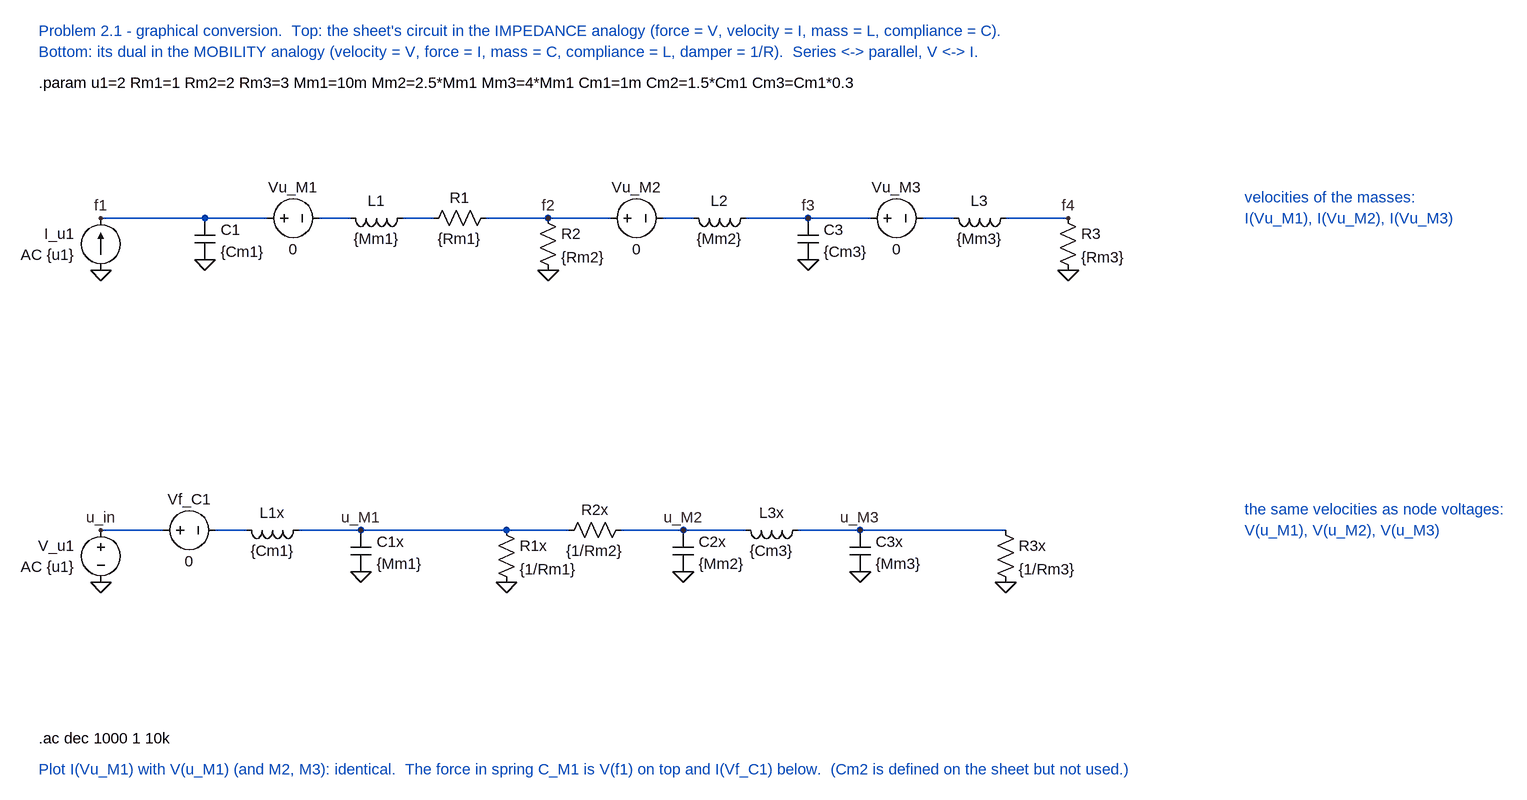
[diagram p0: schematic P2_1_Graphical_Conversion.asc]
P2_1_Graphical_Conversion.asc, the LTspice schematic file:
Version 4
SHEET 1 3000 1600
WIRE 0 0 256 0
WIRE 336 0 384 0
WIRE 464 0 512 0
WIRE 592 0 688 0
WIRE 688 0 784 0
WIRE 864 0 912 0
WIRE 992 0 1088 0
WIRE 1088 0 1184 0
WIRE 1264 0 1312 0
WIRE 1392 0 1488 0
WIRE 0 480 96 480
WIRE 176 480 224 480
WIRE 304 480 400 480
WIRE 400 480 720 480
WIRE 800 480 896 480
WIRE 896 480 992 480
WIRE 1072 480 1168 480
WIRE 1168 480 1392 480
FLAG 0 80 0
FLAG 0 0 f1
FLAG 160 64 0
FLAG 688 80 0
FLAG 688 0 f2
FLAG 1088 64 0
FLAG 1088 0 f3
FLAG 1488 80 0
FLAG 1488 0 f4
FLAG 0 560 0
FLAG 0 480 u_in
FLAG 400 480 u_M1
FLAG 400 544 0
FLAG 624 560 0
FLAG 896 480 u_M2
FLAG 896 544 0
FLAG 1168 480 u_M3
FLAG 1168 544 0
FLAG 1392 560 0
SYMBOL current 0 80 R180
WINDOW 0 40 56 Left 2
WINDOW 3 40 24 Left 2
SYMATTR InstName I_u1
SYMATTR Value AC {u1}
SYMBOL cap 144 0 R0
WINDOW 0 40 18 Left 2
WINDOW 3 40 52 Left 2
SYMATTR InstName C1
SYMATTR Value {Cm1}
SYMBOL voltage 240 0 R270
WINDOW 0 32 56 VTop 2
WINDOW 3 -32 56 VBottom 2
SYMATTR InstName Vu_M1
SYMATTR Value 0
SYMBOL ind 480 -16 R90
WINDOW 0 5 56 VBottom 2
WINDOW 3 32 56 VTop 2
SYMATTR InstName L1
SYMATTR Value {Mm1}
SYMATTR SpiceLine Rser=0
SYMBOL res 608 -16 R90
WINDOW 0 0 56 VBottom 2
WINDOW 3 32 56 VTop 2
SYMATTR InstName R1
SYMATTR Value {Rm1}
SYMBOL res 672 -16 R0
SYMATTR InstName R2
SYMATTR Value {Rm2}
SYMBOL voltage 768 0 R270
WINDOW 0 32 56 VTop 2
WINDOW 3 -32 56 VBottom 2
SYMATTR InstName Vu_M2
SYMATTR Value 0
SYMBOL ind 1008 -16 R90
WINDOW 0 5 56 VBottom 2
WINDOW 3 32 56 VTop 2
SYMATTR InstName L2
SYMATTR Value {Mm2}
SYMATTR SpiceLine Rser=0
SYMBOL cap 1072 0 R0
WINDOW 0 40 18 Left 2
WINDOW 3 40 52 Left 2
SYMATTR InstName C3
SYMATTR Value {Cm3}
SYMBOL voltage 1168 0 R270
WINDOW 0 32 56 VTop 2
WINDOW 3 -32 56 VBottom 2
SYMATTR InstName Vu_M3
SYMATTR Value 0
SYMBOL ind 1408 -16 R90
WINDOW 0 5 56 VBottom 2
WINDOW 3 32 56 VTop 2
SYMATTR InstName L3
SYMATTR Value {Mm3}
SYMATTR SpiceLine Rser=0
SYMBOL res 1472 -16 R0
SYMATTR InstName R3
SYMATTR Value {Rm3}
SYMBOL voltage 0 464 R0
WINDOW 0 -40 40 Right 2
WINDOW 3 -40 72 Right 2
SYMATTR InstName V_u1
SYMATTR Value AC {u1}
SYMBOL voltage 80 480 R270
WINDOW 0 32 56 VTop 2
WINDOW 3 -32 56 VBottom 2
SYMATTR InstName Vf_C1
SYMATTR Value 0
SYMBOL ind 320 464 R90
WINDOW 0 5 56 VBottom 2
WINDOW 3 32 56 VTop 2
SYMATTR InstName L1x
SYMATTR Value {Cm1}
SYMATTR SpiceLine Rser=0
SYMBOL cap 384 480 R0
WINDOW 0 40 18 Left 2
WINDOW 3 40 52 Left 2
SYMATTR InstName C1x
SYMATTR Value {Mm1}
SYMBOL res 608 464 R0
SYMATTR InstName R1x
SYMATTR Value {1/Rm1}
SYMBOL res 816 464 R90
WINDOW 0 0 56 VBottom 2
WINDOW 3 32 56 VTop 2
SYMATTR InstName R2x
SYMATTR Value {1/Rm2}
SYMBOL cap 880 480 R0
WINDOW 0 40 18 Left 2
WINDOW 3 40 52 Left 2
SYMATTR InstName C2x
SYMATTR Value {Mm2}
SYMBOL ind 1088 464 R90
WINDOW 0 5 56 VBottom 2
WINDOW 3 32 56 VTop 2
SYMATTR InstName L3x
SYMATTR Value {Cm3}
SYMATTR SpiceLine Rser=0
SYMBOL cap 1152 480 R0
WINDOW 0 40 18 Left 2
WINDOW 3 40 52 Left 2
SYMATTR InstName C3x
SYMATTR Value {Mm3}
SYMBOL res 1376 464 R0
SYMATTR InstName R3x
SYMATTR Value {1/Rm3}
TEXT -96 -288 Left 2 ;Problem 2.1 - graphical conversion.  Top: the sheet's circuit in the IMPEDANCE analogy (force = V, velocity = I, mass = L, compliance = C).
TEXT -96 -256 Left 2 ;Bottom: its dual in the MOBILITY analogy (velocity = V, force = I, mass = C, compliance = L, damper = 1/R).  Series <-> parallel, V <-> I.
TEXT -96 -208 Left 2 !.param u1=2 Rm1=1 Rm2=2 Rm3=3 Mm1=10m Mm2=2.5*Mm1 Mm3=4*Mm1 Cm1=1m Cm2=1.5*Cm1 Cm3=Cm1*0.3
TEXT 1760 -32 Left 2 ;velocities of the masses:
TEXT 1760 0 Left 2 ;I(Vu_M1), I(Vu_M2), I(Vu_M3)
TEXT 1760 448 Left 2 ;the same velocities as node voltages:
TEXT 1760 480 Left 2 ;V(u_M1), V(u_M2), V(u_M3)
TEXT -96 800 Left 2 !.ac dec 1000 1 10k
TEXT -96 848 Left 2 ;Plot I(Vu_M1) with V(u_M1) (and M2, M3): identical.  The force in spring C_M1 is V(f1) on top and I(Vf_C1) below.  (Cm2 is defined on the sheet but not used.)

The netlist it stands for:
* P2_1_Graphical_Conversion.asc
I_u1 0 f1 AC {u1}
C1 f1 0 {Cm1}
Vu_M1 f1 N001 0
L1 N002 N001 {Mm1} Rser=0
R1 f2 N002 {Rm1}
R2 f2 0 {Rm2}
Vu_M2 f2 N003 0
L2 f3 N003 {Mm2} Rser=0
C3 f3 0 {Cm3}
Vu_M3 f3 N004 0
L3 f4 N004 {Mm3} Rser=0
R3 f4 0 {Rm3}
V_u1 u_in 0 AC {u1}
Vf_C1 u_in N005 0
L1x u_M1 N005 {Cm1} Rser=0
C1x u_M1 0 {Mm1}
R1x u_M1 0 {1/Rm1}
R2x u_M2 u_M1 {1/Rm2}
C2x u_M2 0 {Mm2}
L3x u_M3 u_M2 {Cm3} Rser=0
C3x u_M3 0 {Mm3}
R3x u_M3 0 {1/Rm3}
* Problem 2.1 - graphical conversion.  Top: the sheet's circuit in the IMPEDANCE analogy (force = V, velocity = I, mass = L, compliance = C).
* Bottom: its dual in the MOBILITY analogy (velocity = V, force = I, mass = C, compliance = L, damper = 1/R).  Series <-> parallel, V <-> I.
.param u1=2 Rm1=1 Rm2=2 Rm3=3 Mm1=10m Mm2=2.5*Mm1 Mm3=4*Mm1 Cm1=1m Cm2=1.5*Cm1 Cm3=Cm1*0.3
* velocities of the masses:
* I(Vu_M1), I(Vu_M2), I(Vu_M3)
* the same velocities as node voltages:
* V(u_M1), V(u_M2), V(u_M3)
.ac dec 1000 1 10k
* Plot I(Vu_M1) with V(u_M1) (and M2, M3): identical.  The force in spring C_M1 is V(f1) on top and I(Vf_C1) below.  (Cm2 is defined on the sheet but not used.)
.backanno
.end